# Altium project ESP32_P4_M3.PrjPcb (part 2 of 2)

## Sheet SENSOR.SchDoc
size A4; SheetNumber: 9; SheetTotal: 11
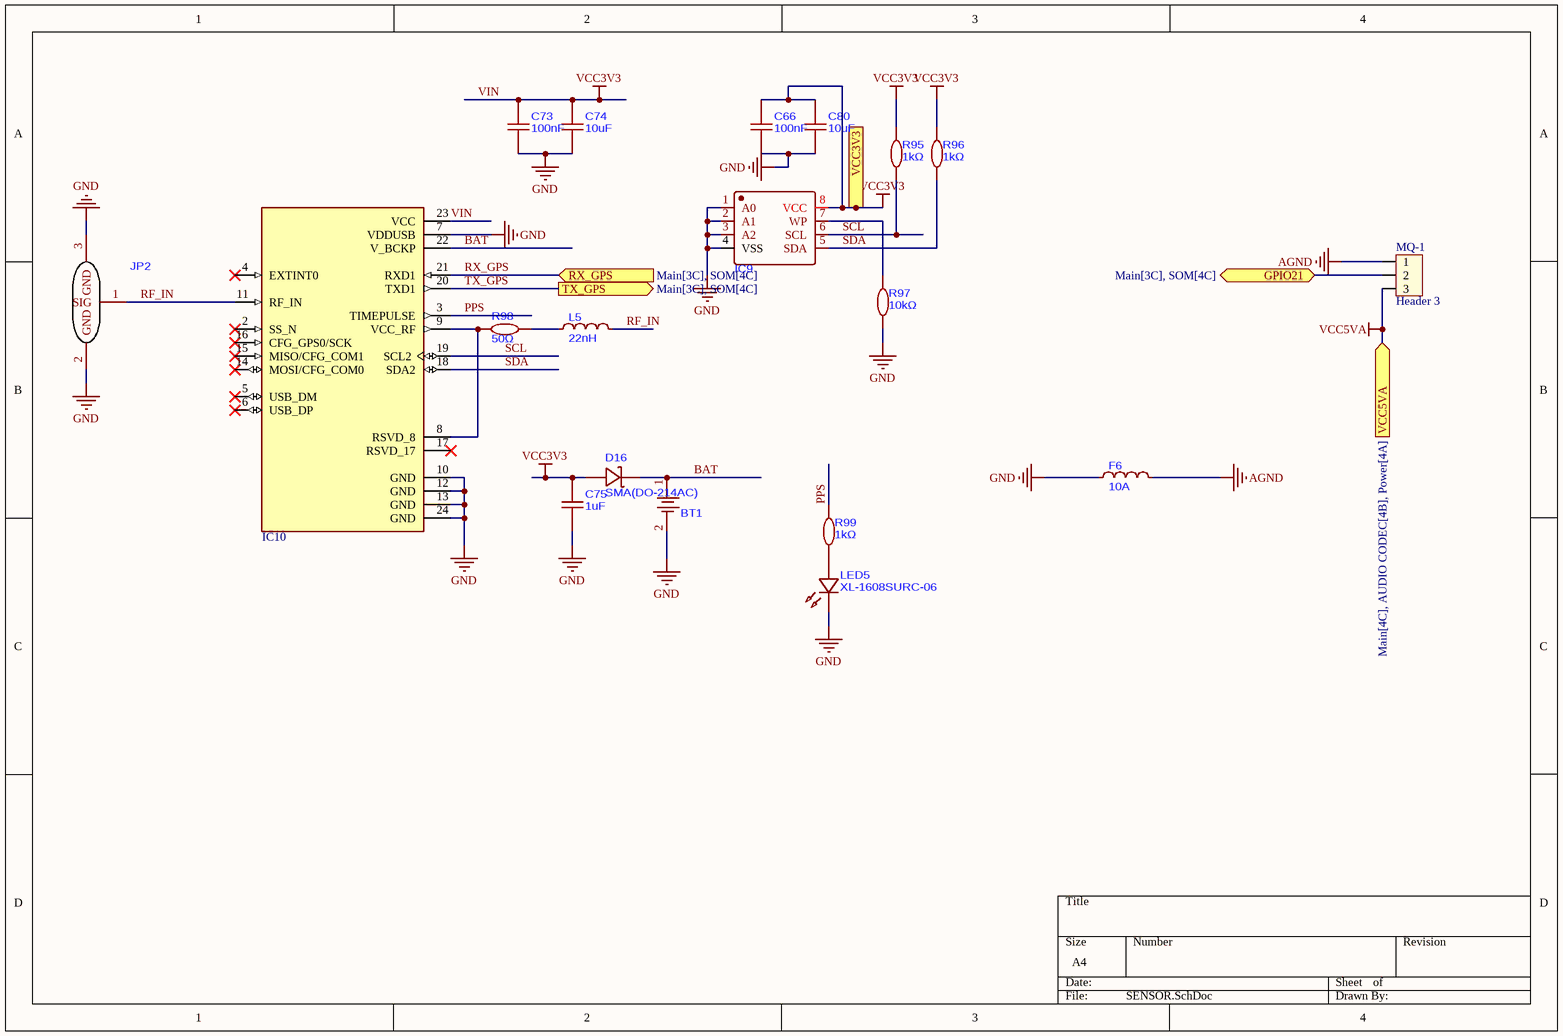
[diagram p9: SENSOR.SchDoc]

### Parts
BT1  BATTERY CLIP COIN CR2032 SMD  [BATTERY]  (value not drawn)
C66  100nF  [C0603]
C73  100nF  [C0603]
C74  10uF  [C0603]
C75  1uF  [C0603]
C80  10uF  [C0603]
D16  SMA(DO-214AC)  [SMA_L4.4-W2.6-LS5.0-RD]
F6  10A  [IND-SMD_L8.5-W3.1]
IC9  256 kb Serial CMOS EEPROM with I2C Protocol  [SOIC-8_L4.9-W3.9-P1.27-LS6.0-BL]  (value not drawn)
IC10  GPS NEO 6  [XCVR_NEO-6M-GPS]  (value not drawn)
JP2  CONN RCPT IPEX 50Ω SMD  [RF-SMD_FRF05002-JSS103M]  (value not drawn)
L5  22nH  [C0603]
LED5  XL-1608SURC-06  [LED0603-RD_RED]
MQ-1  Header 3  [HED3]
R95  1kΩ  [R0603]
R96  1kΩ  [R0603]
R97  10kΩ  [R0603]
R98  50Ω  [R0603]
R99  1kΩ  [R0603]

### Ports
GPIO21 (bidir, see Main[3C], SOM[4C]), RX_GPS (in, see Main[3C], SOM[4C]), TX_GPS (out, see Main[3C], SOM[4C]), VCC3V3 (in, see Main[4C], AUDIO CODEC[2C], Power[4C], SOM[4A], USB[4C]), VCC5VA (in, see Main[4C], AUDIO CODEC[4B], Power[4A])

### Nets
AGND: F6.2 MQ-1.1
GND: BT1.2 C66.1 C73.1 C74.1 C75.1 C80.1 F6.1 IC9.1(A0) IC9.2(A1) IC9.3(A2) IC9.4(VSS) IC10.7(VDDUSB) IC10.10(GND) IC10.12(GND) IC10.13(GND) IC10.24(GND) JP2.2(GND) JP2.3(GND) LED5.1(K) R97.1
VCC3V3: C66.2 C73.2 C74.2 C75.2 C80.2 D16.2(A) IC9.8(VCC) IC10.23(VCC) R95.2 R96.2 ; port VCC3V3  [also labelled VIN]
VCC5VA: MQ-1.3 ; port VCC5VA
BAT: BT1.1 D16.1(K) IC10.22(V_BCKP)
GPIO21: MQ-1.2 ; port GPIO21
PPS: IC10.3(TIMEPULSE) R99.2
RF_IN: IC10.11(RF_IN) JP2.1(SIG) L5.2
RX_GPS: IC10.21(RXD1) ; port RX_GPS  [project net GPIO23]
SCL: IC9.6(SCL) IC10.19(SCL2) R95.1
SDA: IC9.5(SDA) IC10.18(SDA2) R96.1
TX_GPS: IC10.20(TXD1) ; port TX_GPS  [project net GPIO22]
NetIC9_7: IC9.7(WP) R97.2
NetIC10_8: IC10.8(RSVD_8) IC10.9(VCC_RF) R98.1
NetL5_1: L5.1 R98.2
NetLED5_2: LED5.2(A) R99.1

Not connected (* = marked no-connect by the designer): IC10 2(SS_N)* 4(EXTINT0)* 5(USB_DM)* 6(USB_DP)* 14(MOSI/CFG_COM0)* 15(MISO/CFG_COM1)* 16(CFG_GPS0/SCK)* 17(RSVD_17)*

### Library data of the parts
BT1 = C70373: Battery Clip CR2032 SMD Blade Type Power Connector Assemblies RoHS
C66 C73 = CC0603KRX7R9BB104: 50V 100nF X7R ±10% 0603 Ceramic Capacitors ROHS
C74 C80 = CL10A106MA8NRNC: 25V 10uF X5R ±20% 0603 Ceramic Capacitors ROHS
C75 = CL10B105KA8NNNC: 25V 1uF X7R ±10% 0603 Ceramic Capacitors ROHS
D16 = B340A-13-F: 80A 40V 500mV@3A 3A SMA(DO-214AC) Single Diodes ROHS
F6 = HI3312X101R-10: 4mΩ 100Ω@100MHz SMD,8.5x3.1mm Ferrite Beads and Chips ROHS
IC9 = CAT24C256WI-GT3: 256Kbit 1.8V~5.5V 1MHz I2C SOIC-8 Memory (ICs) RoHS
IC10 = NEO-6M-GPS: GPS Development Tools SparkFun GNSS-RTK Dead Reckoning Breakout - ZED-F9K (Qwiic); MF: u-blox; SnapEDA_Link: https://www.snapeda.com/parts/NEO-6M-GPS/u-blox/view-part/?ref=snap; MP: NEO-6M-GPS; Availability: Not in stock; Price: None; Check_prices: https://www.snapeda.com/parts/NEO-6M-GPS/u-blox/view-part/?ref=eda; Value: *; Package: None
JP2 = U.FL-R-SMT-1(80): 1 Male Pin IPEX Board Side 1.25mm -40℃~+90℃ 6GHz 50Ω 2mm SMD Coaxial Connector (RF) Assemblies RoHS
L5 = VHF160808H22NJT: 300mA 22nH ±5% 600mΩ 0603 Fixed Inductors RoHS
LED5 = XL-1608SURC-06: 20mA 2.3V Red 50mW 0603 LED Indication - Discrete ROHS
MQ-1 = Hed3: Header 3 (Green); Value: Header 3
R95 R96 R99 = RMC 0603 1K J N: 100mW 1kΩ 50V ±100ppm/℃ Thick Film Resistor ±5% 0603 Chip Resistor - Surface Mount ROHS
R97 = RC0603FR-0710KL: 100mW 10kΩ 75V ±100ppm/℃ Thick Film Resistor ±1% 0603 Chip Resistor - Surface Mount ROHS
R98 = RT0603BRE0750RL: 100mW 50Ω 75V ±50ppm/℃ Thin Film Resistor ±0.1% 0603 Chip Resistor - Surface Mount ROHS

## Sheet RELAY.SchDoc
size A4; SheetNumber: 10; SheetTotal: 10
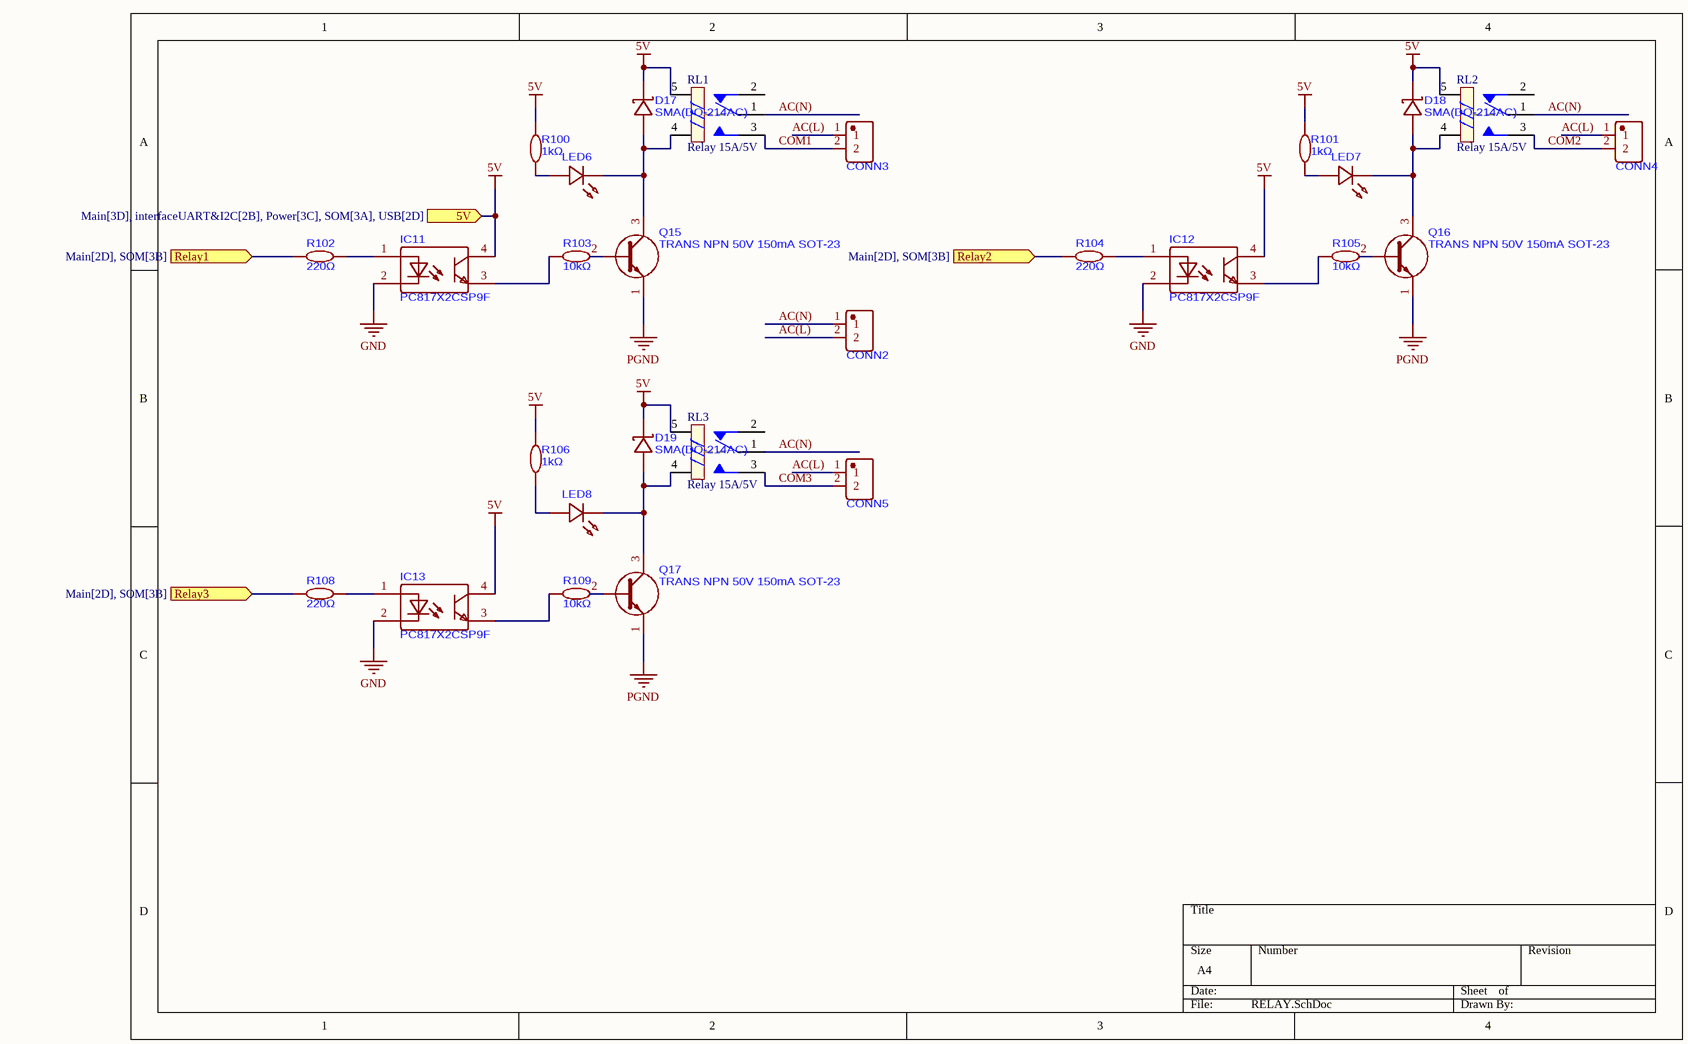
[diagram p10: RELAY.SchDoc]

### Parts
CONN2  TERM BLK 2POS 5mm TH  [CONN-TH_P5.00_KF128-5.0-2P]  (value not drawn)
CONN3  TERM BLK 2POS 5mm TH  [CONN-TH_P5.00_KF128-5.0-2P]  (value not drawn)
CONN4  TERM BLK 2POS 5mm TH  [CONN-TH_P5.00_KF128-5.0-2P]  (value not drawn)
CONN5  TERM BLK 2POS 5mm TH  [CONN-TH_P5.00_KF128-5.0-2P]  (value not drawn)
D17  SMA(DO-214AC)  [SMA_L4.4-W2.6-LS5.0-RD]
D18  SMA(DO-214AC)  [SMA_L4.4-W2.6-LS5.0-RD]
D19  SMA(DO-214AC)  [SMA_L4.4-W2.6-LS5.0-RD]
IC11  PC817X2CSP9F  [smd pc817]
IC12  PC817X2CSP9F  [smd pc817]
IC13  PC817X2CSP9F  [smd pc817]
LED6  XL-1608SURC-06  [LED0603-RD_RED]  (value not drawn)
LED7  XL-1608SURC-06  [LED0603-RD_RED]  (value not drawn)
LED8  XL-1608SURC-06  [LED0603-RD_RED]  (value not drawn)
Q15  TRANS NPN 50V 150mA SOT-23  [SOT-23-3_L2.9-W1.3-P1.90-LS2.4-BR]
Q16  TRANS NPN 50V 150mA SOT-23  [SOT-23-3_L2.9-W1.3-P1.90-LS2.4-BR]
Q17  TRANS NPN 50V 150mA SOT-23  [SOT-23-3_L2.9-W1.3-P1.90-LS2.4-BR]
R100  1kΩ  [R0603]
R101  1kΩ  [R0603]
R102  220Ω  [R0603]
R103  10kΩ  [R0603]
R104  220Ω  [R0603]
R105  10kΩ  [R0603]
R106  1kΩ  [R0603]
R108  220Ω  [R0603]
R109  10kΩ  [R0603]
RL1  Relay 15A/5V  [RL-5V-15A]
RL2  Relay 15A/5V  [RL-5V-15A]
RL3  Relay 15A/5V  [RL-5V-15A]

### Ports
5V (in, see Main[3D], interfaceUART&I2C[2B], Power[3C], SOM[3A], USB[2D]), Relay1 (in, see Main[2D], SOM[3B]), Relay2 (in, see Main[2D], SOM[3B]), Relay3 (in, see Main[2D], SOM[3B])

### Nets
5V: D17.1(K) D18.1(K) D19.1(K) IC11.4(COL) IC12.4(COL) IC13.4(COL) R100.2 R101.2 R106.2 RL1.5 RL2.5 RL3.5 ; port 5V
GND: IC11.2(CAT) IC12.2(CAT) IC13.2(CAT)
PGND: Q15.1 Q16.1 Q17.1
AC(L): CONN2.2 CONN3.1 CONN4.1 CONN5.1
AC(N): CONN2.1 RL1.1 RL2.1 RL3.1
COM1: CONN3.2 RL1.3
COM2: CONN4.2 RL2.3
COM3: CONN5.2 RL3.3
GPIO1: R102.1 ; port Relay1
GPIO2: R104.1 ; port Relay2
GPIO3: R108.1 ; port Relay3
NetD17_2: D17.2(A) LED6.1(K) Q15.3 RL1.4
NetD18_2: D18.2(A) LED7.1(K) Q16.3 RL2.4
NetD19_2: D19.2(A) LED8.1(K) Q17.3 RL3.4
NetIC11_1: IC11.1(AN) R102.2
NetIC11_3: IC11.3(EM) R103.1
NetIC12_1: IC12.1(AN) R104.2
NetIC12_3: IC12.3(EM) R105.1
NetIC13_1: IC13.1(AN) R108.2
NetIC13_3: IC13.3(EM) R109.1
NetLED6_2: LED6.2(A) R100.1
NetLED7_2: LED7.2(A) R101.1
NetLED8_2: LED8.2(A) R106.1
NetQ15_2: Q15.2 R103.2
NetQ16_2: Q16.2 R105.2
NetQ17_2: Q17.2 R109.2

Not connected (* = marked no-connect by the designer): RL1 2; RL2 2; RL3 2

### Library data of the parts
CONN2-CONN5 = KF128-5.0-2P: 2.5 1x2P 12~22 Green 24A -40℃~+105℃ 250V Through Hole 5mm 1 2 Through Hole,P=5mm Wire to Board RoHS
D17-D19 = B340A-13-F: as D16 on sheet SENSOR
IC11-IC13 = PC817X2CSP9F: 50mA 200mV@20mA,1mA 80V 6V DC SMD-4P Transistor, Photovoltaic Output Optoisolators RoHS
LED6-LED8 = XL-1608SURC-06: as LED5 on sheet SENSOR
Q15-Q17 = 2SC1815: 200mW 50V 150mA NPN SOT-23 Single Bipolar Transistors RoHS
R100 R101 R106 = RMC 0603 1K J N: as R95 on sheet SENSOR
R102 R104 R108 = RC0603FR-07220RL: 100mW 220Ω 75V ±100ppm/℃ Thick Film Resistor ±1% 0603 Chip Resistor - Surface Mount RoHS
R103 R105 R109 = RC0603FR-0710KL: as R97 on sheet SENSOR
RL1-RL3 = SRD-05VDC-SL-C: Relay SPDT,10A - 5VDC 5 Pin; Value: Relay SPDT, 10A, 12V

## Nets that join several sheets
5V: Power (8 pins), interfaceUART&I2C (D7.2 Q3.2), USB (8 pins), SOM (H1.2 H1.4), RELAY (12 pins)
AGND: Power (9 pins), AUDIO CODEC (25 pins), SENSOR (F6.2 MQ-1.1)
ESP_3V3: Power (R9.2), interfaceUART&I2C (CN3.3), DSI&CSI CONNECTOR (11 pins), ETH-PHY (R77.2), SOM (R90.1)
ESP_LDO_VO4: MICROSD CARD (R36.1 R39.1), SOM (U2.58)
GND: Power (F2.2), interfaceUART&I2C (9 pins), MICROSD CARD (8 pins), USB (46 pins), DSI&CSI CONNECTOR (17 pins), ETH-PHY (20 pins), SOM (23 pins), SENSOR (20 pins), RELAY (IC11.2 IC12.2 IC13.2)
PGND: Power (34 pins), RELAY (Q15.1 Q16.1 Q17.1)
VCC3V3: Power (8 pins), AUDIO CODEC (R32.1), USB (5 pins), SOM (6 pins), SENSOR (10 pins)
VCC5V: Power (C4.2 L1.2 R1.2 R4.2), USB (Q14.2)
VCC5VA: Power (C8.1 C9.2 F1.2), AUDIO CODEC (C79.1 IC4.6), SENSOR (MQ-1.3)
VCC_IN: Power (6 pins), USB (HD1.1)
BOOTMODE: USB (Q6.3), ETH-PHY (IC8.8), SOM (C72.1 R93.1 SW2.2 U2.54)
CHIP_PU: USB (Q7.3), SOM (C69.1 R92.1 SW1.2 U2.75)
CODEC_I2S0_DSDIN: AUDIO CODEC (IC3.9), SOM (U2.13)
CODEC_I2S0_LRCK: AUDIO CODEC (IC3.8), SOM (U2.14)
CODEC_I2S0_MCLK: AUDIO CODEC (IC3.2), SOM (U2.20)
CODEC_I2S0_SCLK: AUDIO CODEC (IC3.6), SOM (U2.19)
CSI_A_CLK_N: DSI&CSI CONNECTOR (Camera_CSI_interface1.8), SOM (U2.36)
CSI_A_CLK_P: DSI&CSI CONNECTOR (Camera_CSI_interface1.9), SOM (U2.35)
CSI_A_DATA0_N: DSI&CSI CONNECTOR (Camera_CSI_interface1.2), SOM (U2.33)
CSI_A_DATA0_P: DSI&CSI CONNECTOR (Camera_CSI_interface1.3), SOM (U2.34)
CSI_A_DATA1_N: DSI&CSI CONNECTOR (Camera_CSI_interface1.5), SOM (U2.37)
CSI_A_DATA1_P: DSI&CSI CONNECTOR (Camera_CSI_interface1.6), SOM (U2.38)
DSI_A_CLK_N: DSI&CSI CONNECTOR (Display_DSI_interface1.5), SOM (U2.28)
DSI_A_CLK_P: DSI&CSI CONNECTOR (Display_DSI_interface1.6), SOM (U2.29)
DSI_A_DATA0_N: DSI&CSI CONNECTOR (Display_DSI_interface1.8), SOM (U2.31)
DSI_A_DATA0_P: DSI&CSI CONNECTOR (Display_DSI_interface1.9), SOM (U2.30)
DSI_A_DATA1_N: DSI&CSI CONNECTOR (Display_DSI_interface1.2), SOM (U2.27)
DSI_A_DATA1_P: DSI&CSI CONNECTOR (Display_DSI_interface1.3), SOM (U2.26)
ES7210_SDOUT: AUDIO CODEC (IC3.7), SOM (U2.68)
ES_I2C_SCL: interfaceUART&I2C (CN3.2), AUDIO CODEC (R26.1), DSI&CSI CONNECTOR (R71.2 R72.1 R75.1), SOM (C71.2 U2.12)
ES_I2C_SDA: interfaceUART&I2C (CN3.1), AUDIO CODEC (IC3.19), DSI&CSI CONNECTOR (R73.2 R74.1 R76.1), SOM (C70.2 U2.11)
ESP_USB_N: USB (D11.1 USB1.A7 USB1.B7), SOM (U2.39)
ESP_USB_P: USB (D10.1 USB1.A6 USB1.B6), SOM (U2.40)
GPIO1: SOM (H1.7 U2.4), RELAY (R102.1)
GPIO2: SOM (H1.9 U2.5), RELAY (R104.1)
GPIO3: SOM (H1.11 U2.6), RELAY (R108.1)
GPIO21: SOM (U2.22), SENSOR (MQ-1.2)
GPIO22: SOM (U2.23), SENSOR (IC10.20)
GPIO23: SOM (U2.24), SENSOR (IC10.21)
GPIO26: USB (R50.1 R53.1 ZJP1.2), SOM (U2.45)
GPIO27: USB (R47.1 ZJP1.3), SOM (U2.46)
GPIO28: ETH-PHY (IC8.19), SOM (U2.47)
GPIO29: ETH-PHY (IC8.18), SOM (U2.48)
GPIO30: ETH-PHY (IC8.17), SOM (U2.49)
GPIO31: ETH-PHY (IC8.22), SOM (U2.50)
GPIO34: ETH-PHY (IC8.9), SOM (U2.53)
GPIO37: interfaceUART&I2C (R33.2), USB (IC7.3), SOM (U2.56)
GPIO38: interfaceUART&I2C (D6.3 R35.2), SOM (U2.57)
GPIO45: MICROSD CARD (R42.2), SOM (H1.14 U2.65)
GPIO49: ETH-PHY (IC8.5), SOM (H1.25 U2.69)
GPIO50: ETH-PHY (IC8.10 IC8.14), SOM (U2.70)
GPIO51: ETH-PHY (IC8.32), SOM (U2.71)
GPIO52: ETH-PHY (IC8.23 R78.1), SOM (U2.72)
NetIC4_1: AUDIO CODEC (IC4.1 R29.2), SOM (U2.15)
SD_CLK: MICROSD CARD (R41.2 TF1.5), SOM (U2.63)
SD_CMD: MICROSD CARD (R40.2 TF1.3), SOM (U2.64)
SD_DATA0: MICROSD CARD (R44.2 TF1.7), SOM (U2.59)
SD_DATA1: MICROSD CARD (R45.2 TF1.8), SOM (U2.60)
SD_DATA2: MICROSD CARD (R37.2 TF1.1), SOM (U2.61)
SD_DATA3: MICROSD CARD (R38.2 TF1.2), SOM (U2.62)
U0_RX1: interfaceUART&I2C (D6.2), USB (IC7.2)
USB1P1_N: USB (D14.1 USB2.A7 USB2.B7), SOM (U2.42)
USB1P1_P: USB (D13.1 USB2.A6 USB2.B6), SOM (U2.43)